# Altium schematic sheet atWork_Remote.SchDoc
size A3
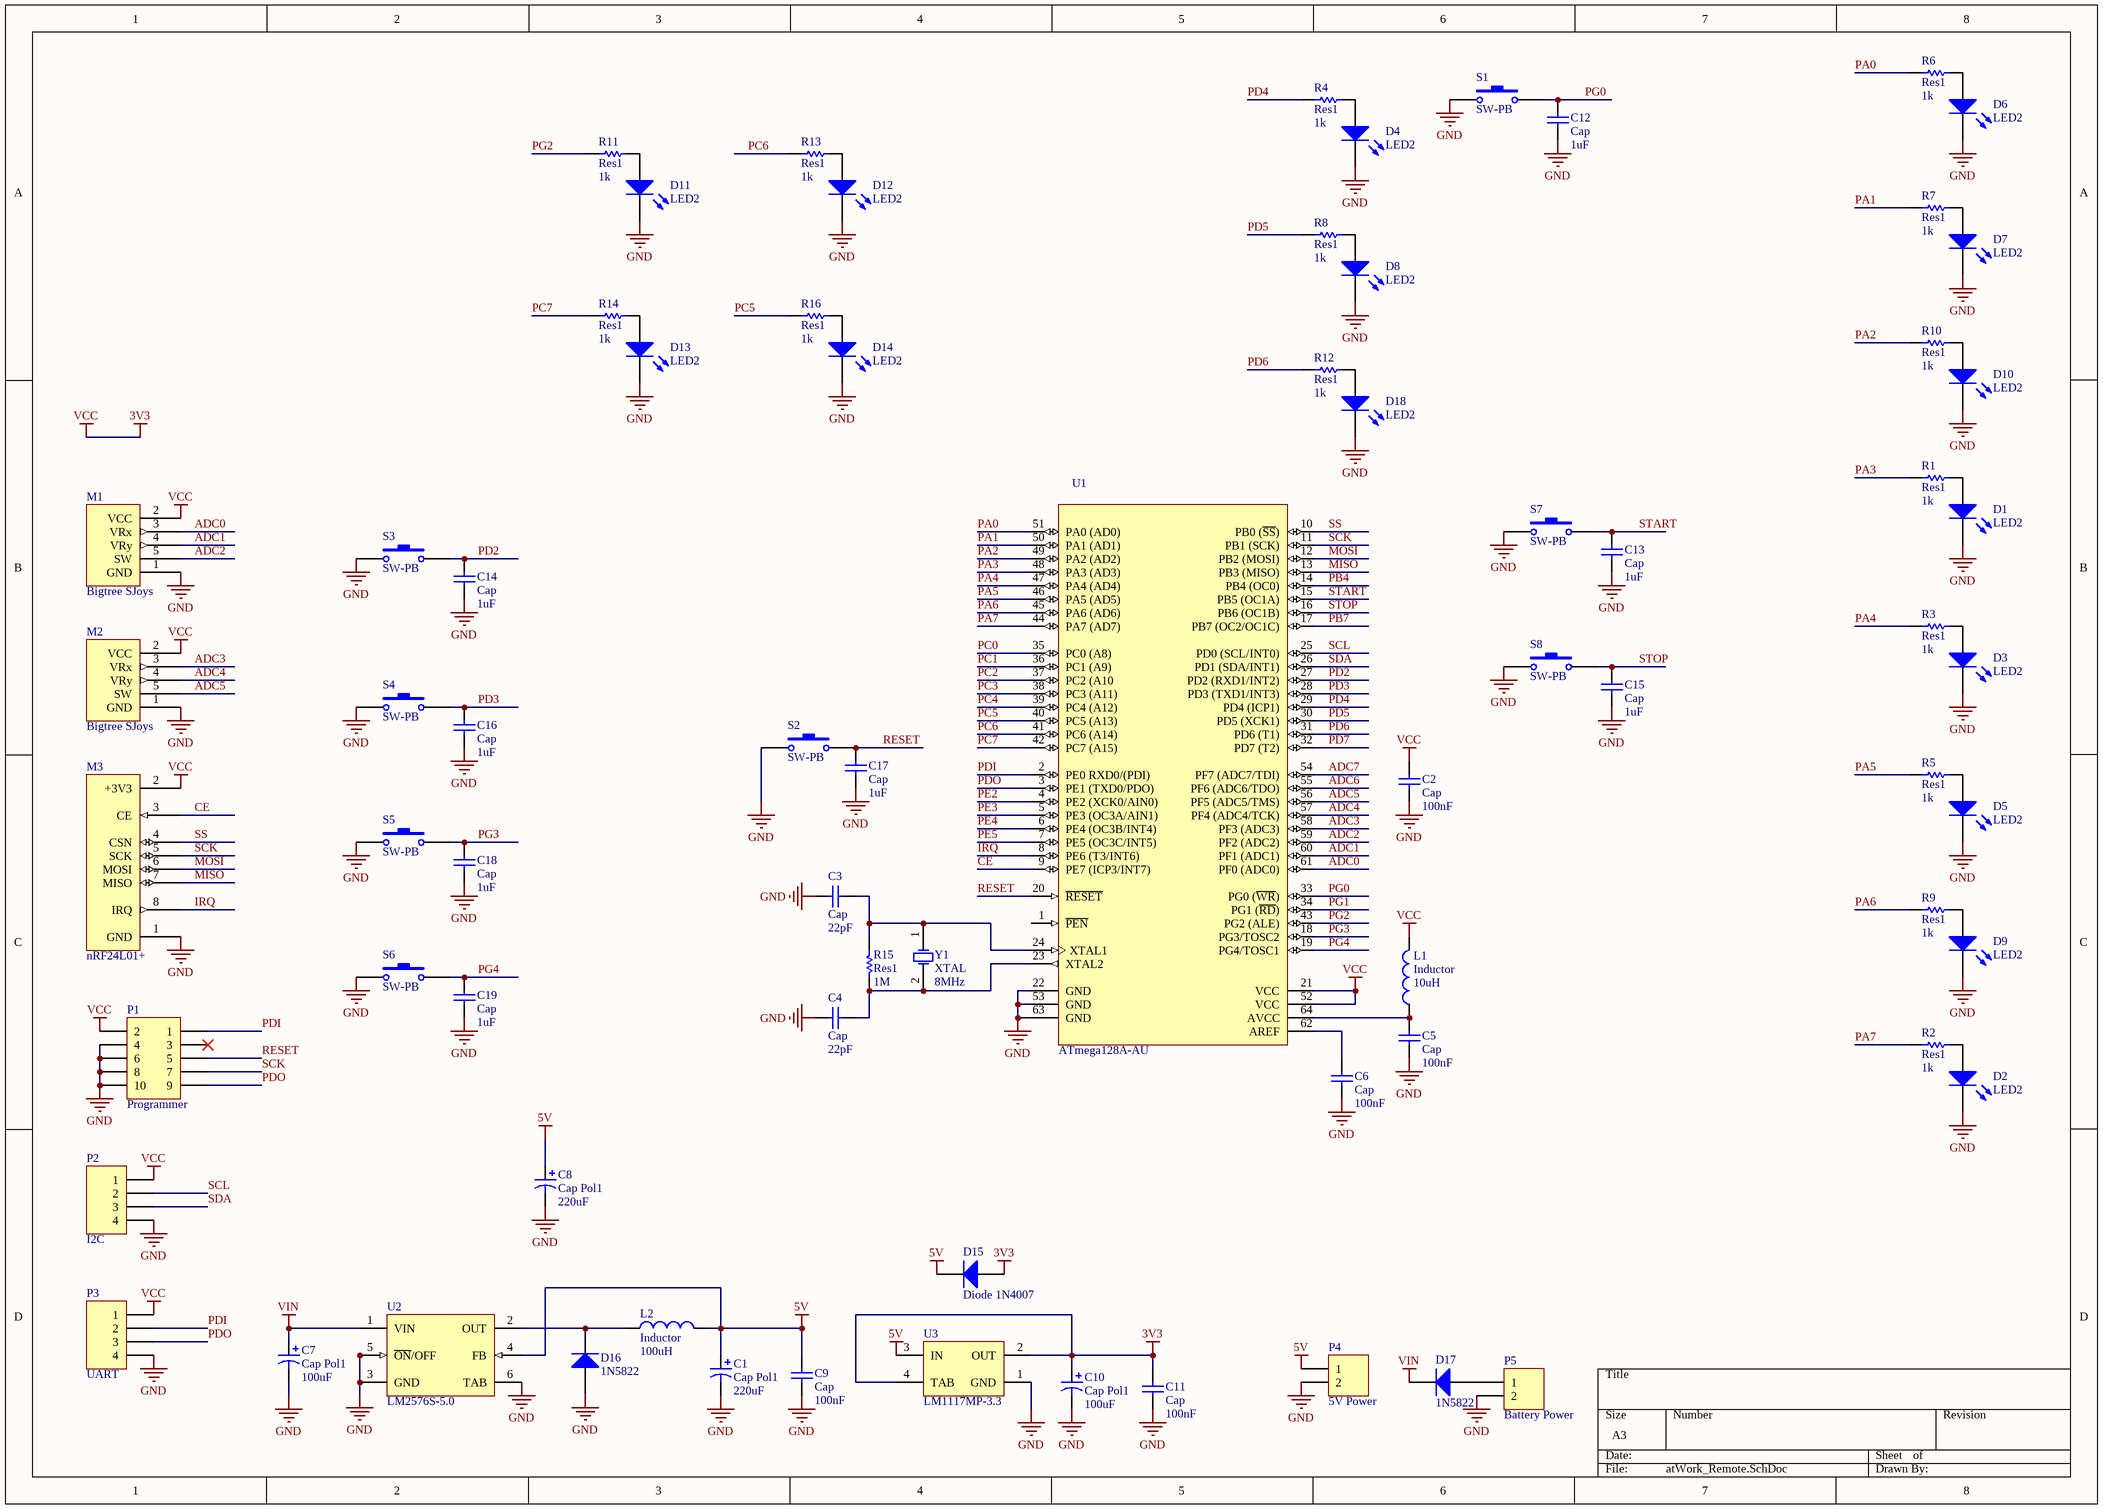
[diagram p0: atWork_Remote.SchDoc]

## Parts
C1  Cap Pol1  value 220uF  [CAP-SMD2]
C2  Cap  value 100nF  [C1206]
C3  Cap  value 22pF  [C1206]
C4  Cap  value 22pF  [C1206]
C5  Cap  value 100nF  [C1206]
C6  Cap  value 100nF  [C1206]
C7  Cap Pol1  value 100uF  [CAP-SMD1]
C8  Cap Pol1  value 220uF  [CAP-SMD2]
C9  Cap  value 100nF  [C1206]
C10  Cap Pol1  value 100uF  [CAP-SMD1]
C11  Cap  value 100nF  [C1206]
C12  Cap  value 1uF  [C1206]
C13  Cap  value 1uF  [C1206]
C14  Cap  value 1uF  [C1206]
C15  Cap  value 1uF  [C1206]
C16  Cap  value 1uF  [C1206]
C17  Cap  value 1uF  [C1206]
C18  Cap  value 1uF  [C1206]
C19  Cap  value 1uF  [C1206]
D1  LED2  [3.2X1.6X1.1]
D2  LED2  [3.2X1.6X1.1]
D3  LED2  [3.2X1.6X1.1]
D4  LED2  [3.2X1.6X1.1]
D5  LED2  [3.2X1.6X1.1]
D6  LED2  [3.2X1.6X1.1]
D7  LED2  [3.2X1.6X1.1]
D8  LED2  [3.2X1.6X1.1]
D9  LED2  [3.2X1.6X1.1]
D10  LED2  [3.2X1.6X1.1]
D11  LED2  [3.2X1.6X1.1]
D12  LED2  [3.2X1.6X1.1]
D13  LED2  [3.2X1.6X1.1]
D14  LED2  [3.2X1.6X1.1]
D15  Diode 1N4007  [DIODE-SMD]
D16  1N5822  [DIODE-SMD]
D17  1N5822  [DIODE-SMD]
D18  LED2  [3.2X1.6X1.1]
L1  Inductor  value 10uH  [C1206]
L2  Inductor  value 100uH  [C1206]
M1  Bigtree SJoys  [BIGTREE_SJOYS]
M2  Bigtree SJoys  [BIGTREE_SJOYS]
M3  nRF24L01+  [NRF24L01+]
P1  Programmer  [BOX2X5_RIGHT]
P2  I2C  [XH4PIN]
P3  UART  [XH4PIN]
P4  5V Power  [XH2PIN]
P5  Battery Power  [XH2PIN]
R1  Res1  value 1k  [C1206]
R2  Res1  value 1k  [C1206]
R3  Res1  value 1k  [C1206]
R4  Res1  value 1k  [C1206]
R5  Res1  value 1k  [C1206]
R6  Res1  value 1k  [C1206]
R7  Res1  value 1k  [C1206]
R8  Res1  value 1k  [C1206]
R9  Res1  value 1k  [C1206]
R10  Res1  value 1k  [C1206]
R11  Res1  value 1k  [C1206]
R12  Res1  value 1k  [C1206]
R13  Res1  value 1k  [C1206]
R14  Res1  value 1k  [C1206]
R15  Res1  value 1M  [C1206]
R16  Res1  value 1k  [C1206]
S1  SW-PB  [PUSH1]
S2  SW-PB  [PUSH1]
S3  SW-PB  [PUSH-OMRON]
S4  SW-PB  [PUSH-OMRON]
S5  SW-PB  [PUSH-OMRON]
S6  SW-PB  [PUSH-OMRON]
S7  SW-PB  [PUSH1]
S8  SW-PB  [PUSH1]
U1  ATmega128A-AU  [64A_M]
U2  LM2576S-5.0  [TS5B_M]
U3  LM1117MP-3.3  [MP04A_M]
Y1  XTAL  value 8MHz  [XTAL-SMD]

## Nets
3V3: C2.2 C10.1 C11.2 D15.1(A) L1.2 M1.2(VCC) M2.2(VCC) M3.2(+3V3) P1.2 P2.1 P3.1 U1.21(VCC) U1.52(VCC) U3.2(OUT) U3.4(TAB)  [also labelled VCC]
5V: C1.1 C8.1 C9.2 D15.2(K) L2.2 P4.1 U2.4(FB) U3.3(IN)
GND: C1.2 C2.1 C3.1 C4.1 C5.1 C6.1 C7.2 C8.2 C9.1 C10.2 C11.1 C12.2 C13.2 C14.2 C15.2 C16.2 C17.2 C18.2 C19.2 D1.2(K) D2.2(K) D3.2(K) D4.2(K) D5.2(K) D6.2(K) D7.2(K) D8.2(K) D9.2(K) D10.2(K) D11.2(K) D12.2(K) D13.2(K) D14.2(K) D16.1(A) D18.2(K) M1.1(GND) M2.1(GND) M3.1(GND) P1.4 P1.6 P1.8 P1.10 P2.4 P3.4 P4.2 P5.2 S1.1 S2.1 S3.1 S4.1 S5.1 S6.1 S7.1 S8.1 U1.22(GND) U1.53(GND) U1.63(GND) U2.3(GND) U2.5(~{ON}/OFF) U2.6(TAB) U3.1(GND)
VIN: C7.1 D17.2(K) U2.1(VIN)
ADC0: M1.3(VRx) U1.61(PF0_(ADC0))
ADC1: M1.4(VRy) U1.60(PF1_(ADC1))
ADC2: M1.5(SW) U1.59(PF2_(ADC2))
ADC3: M2.3(VRx) U1.58(PF3_(ADC3))
ADC4: M2.4(VRy) U1.57(PF4_(ADC4/TCK))
ADC5: M2.5(SW) U1.56(PF5_(ADC5/TMS))
ADC6: U1.55(PF6_(ADC6/TDO))
ADC7: U1.54(PF7_(ADC7/TDI))
CE: M3.3(CE) U1.9(PE7_(ICP3/INT7))
IRQ: M3.8(IRQ) U1.8(PE6_(T3/INT6))
MISO: M3.7(MISO) U1.13(PB3_(MISO))
MOSI: M3.6(MOSI) U1.12(PB2_(MOSI))
PA0: R6.2 U1.51(PA0_(AD0))
PA1: R7.2 U1.50(PA1_(AD1))
PA2: R10.2 U1.49(PA2_(AD2))
PA3: R1.2 U1.48(PA3_(AD3))
PA4: R3.2 U1.47(PA4_(AD4))
PA5: R5.2 U1.46(PA5_(AD5))
PA6: R9.2 U1.45(PA6_(AD6))
PA7: R2.2 U1.44(PA7_(AD7))
PB4: U1.14(PB4_(OC0))
PB7: U1.17(PB7_(OC2/OC1C))
PC0: U1.35(PC0_(A8))
PC1: U1.36(PC1_(A9))
PC2: U1.37(PC2_(A10)
PC3: U1.38(PC3_(A11))
PC4: U1.39(PC4_(A12))
PC5: R16.2 U1.40(PC5_(A13))
PC6: R13.2 U1.41(PC6_(A14))
PC7: R14.2 U1.42(PC7_(A15))
PD2: C14.1 S3.2 U1.27(PD2_(RXD1/INT2))
PD3: C16.1 S4.2 U1.28(PD3_(TXD1/INT3))
PD4: R4.2 U1.29(PD4_(ICP1))
PD5: R8.2 U1.30(PD5_(XCK1))
PD6: R12.2 U1.31(PD6_(T1))
PD7: U1.32(PD7_(T2))
PDI: P1.1 P3.2 U1.2(PE0_RXD0/(PDI))
PDO: P1.9 P3.3 U1.3(PE1_(TXD0/PDO))
PE2: U1.4(PE2_(XCK0/AIN0))
PE3: U1.5(PE3_(OC3A/AIN1))
PE4: U1.6(PE4_(OC3B/INT4))
PE5: U1.7(PE5_(OC3C/INT5))
PG0: C12.1 S1.2 U1.33(PG0_(~{WR}))
PG1: U1.34(PG1_(~{RD}))
PG2: R11.2 U1.43(PG2_(ALE))
PG3: C18.1 S5.2 U1.18(PG3/TOSC2)
PG4: C19.1 S6.2 U1.19(PG4/TOSC1)
RESET: C17.1 P1.5 S2.2 U1.20(~{RESET})
SCK: M3.5(SCK) P1.7 U1.11(PB1_(SCK))
SCL: P2.2 U1.25(PD0_(SCL/INT0))
SDA: P2.3 U1.26(PD1_(SDA/INT1))
SS: M3.4(CSN) U1.10(PB0_(~{SS}))
START: C13.1 S7.2 U1.15(PB5_(OC1A))
STOP: C15.1 S8.2 U1.16(PB6_(OC1B))
NetC3_2: C3.2 R15.1 U1.24(XTAL1) Y1.1(OSC1)
NetC4_2: C4.2 R15.2 U1.23(XTAL2) Y1.2(OSC2)
NetC5_2: C5.2 L1.1 U1.64(AVCC)
NetC6_2: C6.2 U1.62(AREF)
NetD1_1: D1.1(A) R1.1
NetD2_1: D2.1(A) R2.1
NetD3_1: D3.1(A) R3.1
NetD4_1: D4.1(A) R4.1
NetD5_1: D5.1(A) R5.1
NetD6_1: D6.1(A) R6.1
NetD7_1: D7.1(A) R7.1
NetD8_1: D8.1(A) R8.1
NetD9_1: D9.1(A) R9.1
NetD10_1: D10.1(A) R10.1
NetD11_1: D11.1(A) R11.1
NetD12_1: D12.1(A) R13.1
NetD13_1: D13.1(A) R14.1
NetD14_1: D14.1(A) R16.1
NetD16_2: D16.2(K) L2.1 U2.2(OUT)
NetD17_1: D17.1(A) P5.1
NetD18_1: D18.1(A) R12.1

Not connected (* = marked no-connect by the designer): P1 3*; U1 1(~{PEN})

## Library data of the parts
C1 C7 C8 C10 = Cap Pol1: Polarized Capacitor (Radial); Published: 8-Jun-2000; LatestRevisionDate: 17-Jul-2002; LatestRevisionNote: Re-released for DXP Platform.; PackageReference: RB7.6-15; Publisher: Altium Limited; PackageDescription: Polarized Capacitor (Radial); 2 Leads
C2-C6 C9 C11-C19 = Cap: Capacitor; Published: 8-Jun-2000; LatestRevisionDate: 17-Jul-2002; LatestRevisionNote: Re-released for DXP Platform.; PackageReference: RAD-0.3; Publisher: Altium Limited; PackageDescription: Radial Cap, Thru-Hole; 2 Leads; 0.3 in Pin Spacing
D1-D14 D18 = LED2: Typical RED, GREEN, YELLOW, AMBER GaAs LED; Published: 8-Jun-2000; LatestRevisionDate: 17-Jul-2002; LatestRevisionNote: Re-released for DXP Platform.; PackageVersion: Feb-2002; PackageReference: 3.2X1.6X1.1; Publisher: Altium Limited; PackageDescription: SM LED; 2 Flat Leads
D15 = Diode 1N4007: 1 Amp General Purpose Rectifier; Published: 8-Jun-2000; LatestRevisionDate: 17-Jul-2002; LatestRevisionNote: Re-released for DXP Platform.; DatasheetVersion: 1998; PackageVersion: Aug-1999; PackageReference: DO-41; Publisher: Altium Limited; PackageDescription: Diode, Axial; Body 5.2 x 2.7 mm (LxDia. max), Lead Dia. 0.86 mm (max); Code_JEDEC: DO-204-AL; ComponentLink1Description: Manufacturer Link; ComponentLink1URL: http://www.fairchildsemi.com/; ComponentLink2Description: Datasheet; ComponentLink2URL: http://www.fairchildsemi.com/ds/1N%2F1N4001.pdf
D16 D17 = Diode: Default Diode; Published: 8-Jun-2000; LatestRevisionDate: 17-Jul-2002; LatestRevisionNote: Re-released for DXP Platform.; PackageVersion: Sep-1996; PackageReference: SMC; Publisher: Altium Limited; PackageDescription: DO-214-AB/SMC; 2 C-Bend Leads; Body 7.9 x 5.9 mm, inc. leads (LxW); Code_JEDEC: DO-214-AB
L1 L2 = Inductor: Code_IEC: 1005; Published: 8-Jun-2000; LatestRevisionDate: 29-May-2009; LatestRevisionNote: IPC-7351 Footprint Added.; PackageReference: 0402-A; Publisher: Altium Limited; PackageDescription: Chip Inductor; Code_JEITA: 0402
M1 M2 = Bigtree SJoys: Dual-Axis Joystick with Button; Designer: Meysam Parvizi; Email: meysam.parvizi.ir@gmail.com; Weblog: http://mp.tabin.ir
M3 = nRF24L01+: nRF24L01 Single Chip 2.4GHz Tranceiver, +PA +LNA Ver5.1; Designer: Meysam Parvizi; Email: meysam.parvizi.ir@gmail.com; Weblog: http://mp.tabin.ir
P1 = Box 5X2: Box, 5-Pin, Dual row; Designer: Meysam Parvizi; Email: meysam.parvizi.ir@gmail.com; Weblog: http://mp.tabin.ir
P2 P3 = Header 4: Header, 4-Pin; LatestRevisionDate: 17-Jul-2002; LatestRevisionNote: Re-released for DXP Platform.; Publisher: Altium Limited
P4 P5 = Header 2: Header, 2-Pin; LatestRevisionDate: 17-Jul-2002; LatestRevisionNote: Re-released for DXP Platform.; Publisher: Altium Limited
R1-R16 = Res1: Resistor; Published: 8-Jun-2000; LatestRevisionDate: 17-Jul-2002; LatestRevisionNote: Re-released for DXP Platform.; PackageReference: AXIAL-0.3; Publisher: Altium Limited; PackageDescription: Axial Device, Thru-Hole; 2 Leads; 0.3 in Pin Spacing
S1-S8 = SW-PB: Switch; Published: 24-Mar-1999; LatestRevisionDate: 17-Jul-2002; LatestRevisionNote: Re-released for DXP Platform.; PackageReference: SPST-2; Publisher: Altium Limited
U1 = ATmega128A-AU: 8-bit AVR Microcontroller, 128KB Flash, 4KB EEPROM, 4KB SRAM, 64-pin TQFP, Industrial Grade (-40°C to 85°C); Published: 1-Apr-2010; DatasheetVersion: revE, Feb-2010; PackageVersion: revB, Oct-2001; PackageReference: 64A; Publisher: Altium Limited; PackageDescription: 64-Pin Plastic Thin Profile Quad Flat Pack, 14 x 14 x 1.0 mm Body, 0.8 mm Pitch (TQFP); Supplier 1: Digi-Key; Supplier Part Number 1: ATMEGA128A-AU-ND; Supplier 2: Farnell; Supplier Part Number 2: 1773397; Supplier 3: Mouser; Supplier Part Number 3: 556-ATMEGA128A-AU; Code_JEDEC: MS-026-AEB; ComponentLink1Description: Manufacturer Link; ComponentLink1URL: http://www.atmel.com/products/avr/default.asp?; ComponentLink2Description: ATmega128A Datasheet; ComponentLink2URL: http://www.atmel.com/dyn/resources/prod_documents/doc8151.pdf; ComponentLink3Description: ATmega128A Summary; ComponentLink3URL: http://www.atmel.com/dyn/resources/prod_documents/8151S.pdf; ComponentLink4Description: Atmel.com Home; ComponentLink4URL: http://www.atmel.com
U2 = LM2576S-5.0: SIMPLE SWITCHER® 3A Step-Down Voltage Regulator, 5-pin TO-263; Manufacturer: National Semiconductor; PackageTopMarking: NSUZXYTTE#*LM2576S*-5.0 P+; PowerWise: N; Published: 4-Dec-2008; DatasheetVersion: Aug-2004; PackageVersion: revD, Apr-2005; PackageReference: TS5B; Publisher: Altium Limited; PackageDescription: TO-263, Molded, .400 x .390 x .180in, 5 Lead, .067in Pitch, Surface Mount; PartNumber: LM2576S-5.0; RoHS: N; PinCount: 5; CompType: Switcher; Code_JEDEC: MO-169-AB; ComponentLink1Description: LM2576 Datasheet; ComponentLink1URL: http://www.national.com/ds/LM/LM2576.pdf; ComponentLink2Description: LM2576 Web Page; ComponentLink2URL: http://www.national.com/pf/LM/LM2576.html; ComponentLink3Description: TS5B Package Page; ComponentLink3URL: http://www.national.com/packaging/folders/ts5b.html
U3 = LM1117MP-3.3: 800mA Low-Dropout Linear Regulator, 4-pin SOT-223; Manufacturer: National Semiconductor; PackageTopMarking: XYTT*N05A; PowerWise: N; CompType: LDO IC; Published: 4-Dec-2008; DatasheetVersion: Apr-2006; PackageVersion: revB, Apr-2003; PackageReference: MP04A; Publisher: Altium Limited; PackageDescription: Molded SOT-223, 6.50 x 3.56 x 1.6mm Body, 4 Lead, 2.3mm Pitch; Supplier 1: Farnell; Supplier Part Number 1: 9778195; Supplier 2: Farnell; Supplier Part Number 2: 9778195RL; PartNumber: LM1117MP-3.3; RoHS: N; PinCount: 4; Code_JEDEC: TO-261-AA; Code_IPC: SOT223-4; ComponentLink1Description: LM1117 Datasheet; ComponentLink1URL: http://www.national.com/ds/LM/LM1117.pdf; ComponentLink2Description: LM1117 Web Page; ComponentLink2URL: http://www.national.com/pf/LM/LM1117.html; ComponentLink3Description: MP04A Package Page; ComponentLink3URL: http://www.national.com/packaging/folders/mp04a.html
Y1 = XTAL: Crystal Oscillator; Designer: Meysam Parvizi; Email: meysam.parvizi.ir@gmail.com; Weblog: http://mp.tabin.ir